# EAGLE design ledboard_segment (EAGLE 7.1.0)
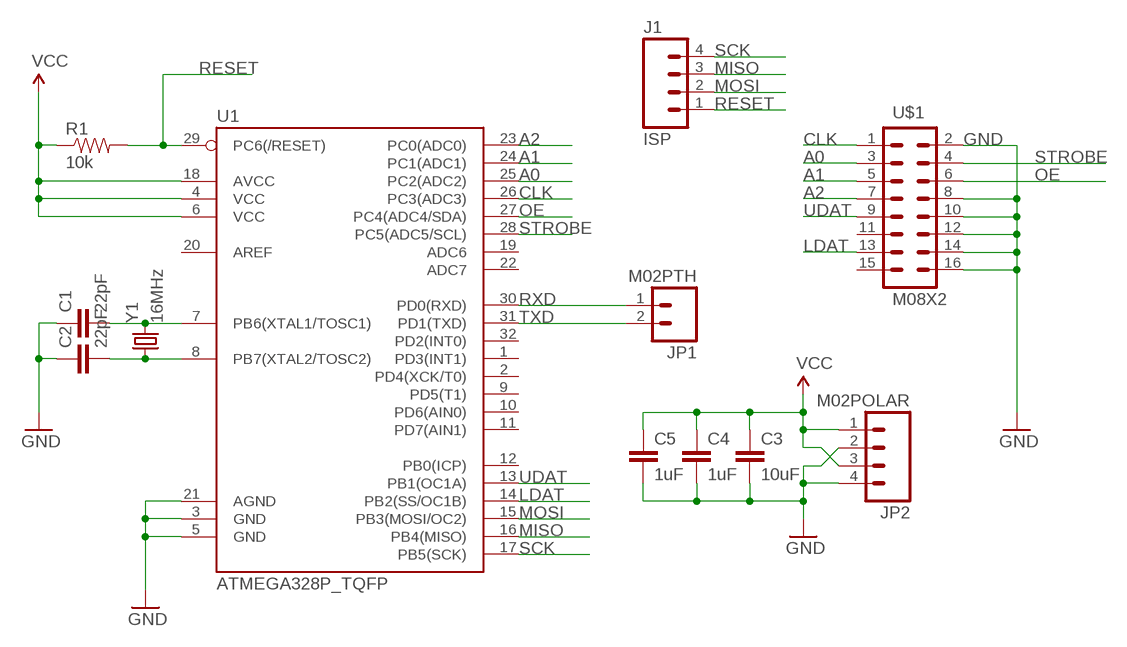
[diagram p0: schematic, sheet 1]

## Parts
C1  22pF  CAP0805  [0805]
C2  22pF  CAP0805  [0805]
C3  10uF  CAP0805  [0805]
C4  1uF  CAP0805  [0805]
C5  1uF  CAP0805  [0805]
J1  ISP  M04PTH  [1X04]
JP1  M02PTH  [1X02]
JP2  M02POLAR  M041X04_NO_SILK  [1X04_NO_SILK]
R1  10k  RESISTOR0805-RES  [0805]
U1  ATMEGA328P_TQFP  [TQFP32-08]
U$1  M08X2  [2X8]
Y1  16MHz  CRYSTALTXC-7A  [CRYSTAL-TXC-7A]

## Nets
A0: U1.25(PC2(ADC2)) U$1.3
A1: U1.24(PC1(ADC1)) U$1.5
A2: U1.23(PC0(ADC0)) U$1.7
CLK: U1.26(PC3(ADC3)) U$1.1
GND: C1.1 C2.1 C3.2 C4.2 C5.2 JP2.2 JP2.4 U1.3(GND) U1.5(GND) U1.21(AGND) U$1.2 U$1.8 U$1.10 U$1.12 U$1.14 U$1.16
LDAT: U1.14(PB2(SS/OC1B)) U$1.13
MISO: J1.3 U1.16(PB4(MISO))
MOSI: J1.2 U1.15(PB3(MOSI/OC2))
OE: U1.27(PC4(ADC4/SDA)) U$1.6
RESET: J1.1 R1.2 U1.29(PC6(/RESET))
RXD: JP1.1 U1.30(PD0(RXD))
SCK: J1.4 U1.17(PB5(SCK))
STROBE: U1.28(PC5(ADC5/SCL)) U$1.4
TXD: JP1.2 U1.31(PD1(TXD))
UDAT: U1.13(PB1(OC1A)) U$1.9
VCC: C3.1 C4.1 C5.1 JP2.1 JP2.3 R1.1 U1.4(VCC) U1.6(VCC) U1.18(AVCC)
XTAL1: C1.2 U1.7(PB6(XTAL1/TOSC1)) Y1.P$2
XTAL2: C2.2 U1.8(PB7(XTAL2/TOSC2)) Y1.P$1
Unconnected: U1.1(PD3(INT1)) U1.2(PD4(XCK/T0)) U1.9(PD5(T1)) U1.10(PD6(AIN0)) U1.11(PD7(AIN1)) U1.12(PB0(ICP)) U1.19(ADC6) U1.20(AREF) U1.22(ADC7) U1.32(PD2(INT0)) U$1.11 U$1.15

## Library data of the parts
C1-C5 = SparkFun-Passives:CAP: Capacitor Standard 0603 ceramic capacitor, and 0.1" leaded capacitor.
J1 JP2 = SparkFun-Connectors:M04: Header 4 Standard 4-pin 0.1" header. Use with straight break away headers (SKU : PRT-00116), right angle break away headers (PRT-00553), swiss pins (PRT-00743), machine pins (PRT-00117), and female headers (PRT-00115). Molex polarized connector foot print use with SKU : PRT-08231 with associated crimp pins and housings. 1MM SMD Version SKU: PRT-10208
JP1 = SparkFun-Connectors:M02: Standard 2-pin 0.1" header. Use with - straight break away headers ( PRT-00116) - right angle break away headers (PRT-00553) - swiss pins (PRT-00743) - machine pins (PRT-00117) - female headers (PRT-00115) Molex polarized connector foot print use with: PRT-08233 with associated crimp pins and housings. 2.54_SCREWTERM for use with PRT-10571. 3.5mm Screw Terminal footprints for PRT-08084 5mm Screw Terminal footprints for use with PRT-08432
R1 = SparkFun-Passives:RESISTOR: Resistor Basic schematic elements and footprints for 0603, 1206, and PTH resistors.
U1 = SparkFun-DigitalIC:ATMEGA328P_TQFP; PROD_ID: IC-09069
U$1 = SparkFun-Connectors:M08X2: .1" headers, two rows of 8 each
Y1 = SparkFun-FreqCtrl:CRYSTAL: Various standard crystals. Proven footprints.

## Board
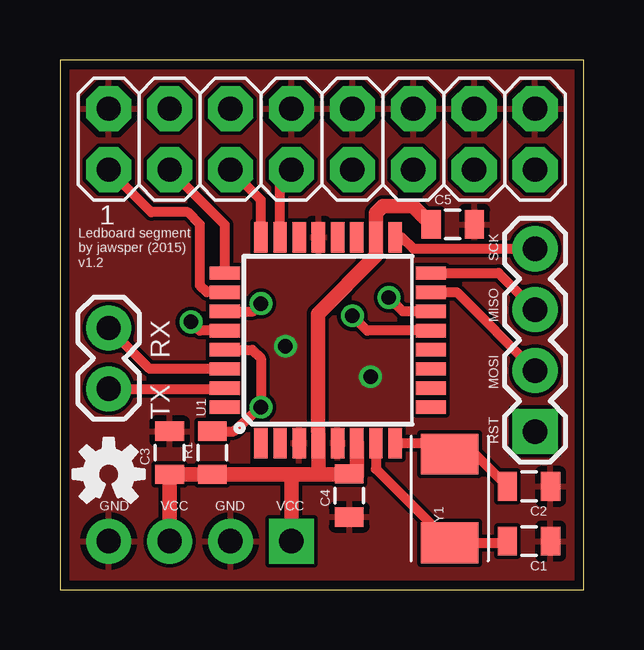
[diagram p1: board, top side]
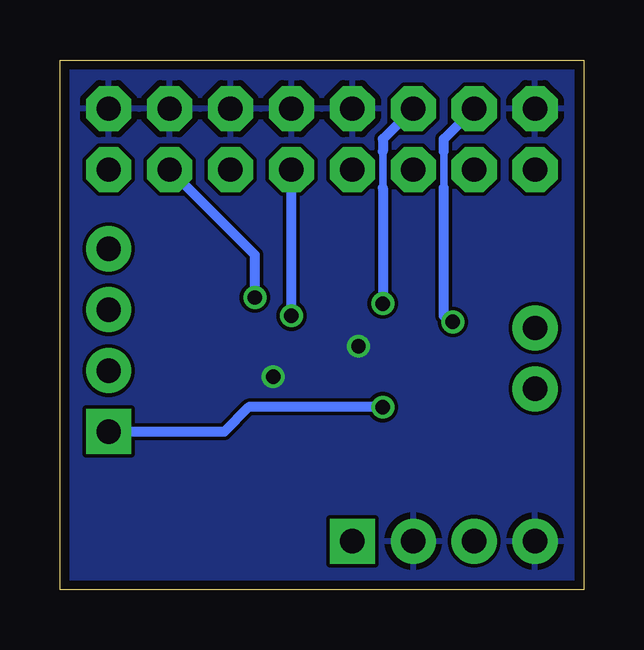
[diagram p2: board, bottom side, seen from below]

Size 21.84 x 22.1 mm. Coordinates in mm from the lower left corner, seen from the top.
Outline: 0,0 21.84,0 21.84,22.1 0,22.09 0,0
Copper layers (1*16): Top 0.0356mm / dielectric 1.5011mm / Bottom 0.0356mm
Design rules "LaenPCBOrder": minimum track width 6mil, minimum drill 13mil, track to track 6mil, track to pad 6mil, pad to pad 6mil, via to via 6mil, smd to smd 6mil, copper to edge 15mil, drill to drill 6mil, minimum pad ring 7mil, minimum via ring 7mil, stop-mask expansion 3mil, vias tented up to drill 0mil, thermal gap 10mil

### Footprints (pad centres in the part's own frame; a part is rotated, then mirrored left to right if it is on the bottom)
0805 = smd 0.8 x 1.2: 1 -0.9,0; 2 0.9,0
1X04 = drill 1.016 pad 1.88 square: 1 0,0 | drill 1.016 pad 1.88: 2 2.54,0; 3 5.08,0; 4 7.62,0
1X02 = drill 1.016 pad 1.88: 1 0,0; 2 2.54,0
1X04_NO_SILK = drill 1.016 pad 1.88 square: 1 0,0 | drill 1.016 pad 1.88: 2 2.54,0; 3 5.08,0; 4 7.62,0
TQFP32-08 = smd 1.27 x 0.559: 1 -4.293,2.8; 2 -4.293,2; 3 -4.293,1.2; 4 -4.293,0.4; 5 -4.293,-0.4; 6 -4.293,-1.2; 7 -4.293,-2; 8 -4.293,-2.8; 17 4.293,-2.8; 18 4.293,-2; 19 4.293,-1.2; 20 4.293,-0.4; 21 4.293,0.4; 22 4.293,1.2; 23 4.293,2; 24 4.293,2.8 | smd 0.559 x 1.27: 9 -2.8,-4.293; 10 -2,-4.293; 11 -1.2,-4.293; 12 -0.4,-4.293; 13 0.4,-4.293; 14 1.2,-4.293; 15 2,-4.293; 16 2.8,-4.293; 25 2.8,4.293; 26 2,4.293; 27 1.2,4.293; 28 0.4,4.293; 29 -0.4,4.293; 30 -1.2,4.293; 31 -2,4.293; 32 -2.8,4.293
2X8 = drill 1.016 pad 1.88 octagon: 1 0,0; 2 0,2.54; 3 2.54,0; 4 2.54,2.54; 5 5.08,0; 6 5.08,2.54; 7 7.62,0; 8 7.62,2.54; 9 10.16,0; 10 10.16,2.54; 11 12.7,0; 12 12.7,2.54; 13 15.24,0; 14 15.24,2.54; 15 17.78,0; 16 17.78,2.54
CRYSTAL-TXC-7A = smd 1.7 x 2.4: P$1 1.85,0; P$2 -1.85,0

### Placement (x,y rotation side)
C1  19.56,2.03 180 top
C2  19.56,4.32 180 top
C3  4.57,5.71 90 top
C4  12.07,3.94 270 top
C5  16.38,15.24 0 top
J1  19.81,6.6 90 top
JP1  2.03,10.92 270 top
JP2  9.65,2.03 180 top
R1  6.35,5.71 90 top
U1  11.18,10.41 90 top
U$1  2.03,17.53 0 top
U$2  [OSHW-LOGO-S]  2.03,4.83 0 top
Y1  16.26,3.81 90 top

### Tracks (layer width: path | path; a pad name or v marks a point on that pad's centre or on a via)
A0
  Top 0.406: U1.25 6.88,15.21 U$1.3
A1
  Top 0.406: U1.24 8.38,16.26 U$1.5
A2
  Top 0.406: U1.23 9.18,17.05 U$1.7
CLK
  Top 0.406: U1.26 6.13,12.41 5.84,12.7 5.84,15.24 5.33,15.75 3.81,15.75 U$1.1
GND  (via drill 0.6)
  other vias: 9.4,10.16 12.95,8.89
  pour Bottom: 0,22.1 21.84,22.1 21.84,0 0,0
  pour Top: -0.25,22.35 22.1,22.35 22.1,-0.25 -0.76,-0.25 -1.02,0
LDAT  (via drill 0.6)
  Top 0.406: U1.14 14.29,11.61 v13.72,12.19
  Bottom 0.406: v13.72,12.19 13.72,13.97 U$1.13
MISO
  Top 0.406: U1.16 18.28,13.21 J1.3
MOSI
  Top 0.406: U1.15 16.54,12.41 J1.2
OE  (via drill 0.6)
  Top 0.406: v8.38,11.94 8.06,11.61 U1.27
  Bottom 0.305: 8.38,18.29 8.38,16.76
  Bottom 0.406: U$1.6 8.38,18.8 8.38,18.29 | 8.38,16.76 v8.38,11.94
RESET  (via drill 0.6)
  Top 0.406: U1.29 8.02,10.01 8.38,9.65 v8.38,7.62 7.25,6.61 R1.2
  Bottom 0.406: v8.38,7.62 13.97,7.62 14.99,6.6 J1.1
RXD
  Top 0.406: U1.30 3.74,9.21 JP1.1
SCK
  Top 0.406: U1.17 14.25,14.71 14.73,14.22 J1.4
STROBE  (via drill 0.6)
  Top 0.406: U1.28 5.82,10.81 v5.46,11.18
  Bottom 0.305: 5.84,16.76 5.84,18.29
  Bottom 0.406: v5.46,11.18 5.46,11.05 5.84,11.43 5.84,16.76 | 5.84,18.29 5.84,18.8 U$1.4
TXD
  Top 0.406: JP1.2 6.85,8.38 U1.31
UDAT  (via drill 0.6)
  Top 0.406: U1.13 12.81,10.81 v12.19,11.43
  Bottom 0.406: v12.19,11.43 U$1.9
VCC
  Top 0.61: JP2.3 C3.1 R1.1 9.65,4.81 | 9.65,4.81 10.92,4.81 | 10.92,4.81 12.04,4.81 C4.1 12.38,4.77 U1.6 | 10.92,4.81 10.78,4.83 U1.4 10.75,6.98 10.75,11.51 13.18,13.94 U1.18 13.18,15.72 13.46,16 14.72,16 C5.1 | JP2.1 9.65,4.81
XTAL1
  Top 0.406: U1.7 13.18,5.04 Y1.P$2 18.59,1.96 C1.2
XTAL2
  Top 0.406: U1.8 15.79,6.12 Y1.P$1 17.32,5.66 C2.2

### Text on the board
tNames: 1 | Ledboard segment / by jawsper (2015) / v1.2 | SCK | MISO | RX | MOSI | TX | RST | GND | VCC | GND | VCC